# EAGLE design cartridge_reader (EAGLE 7.6.0)
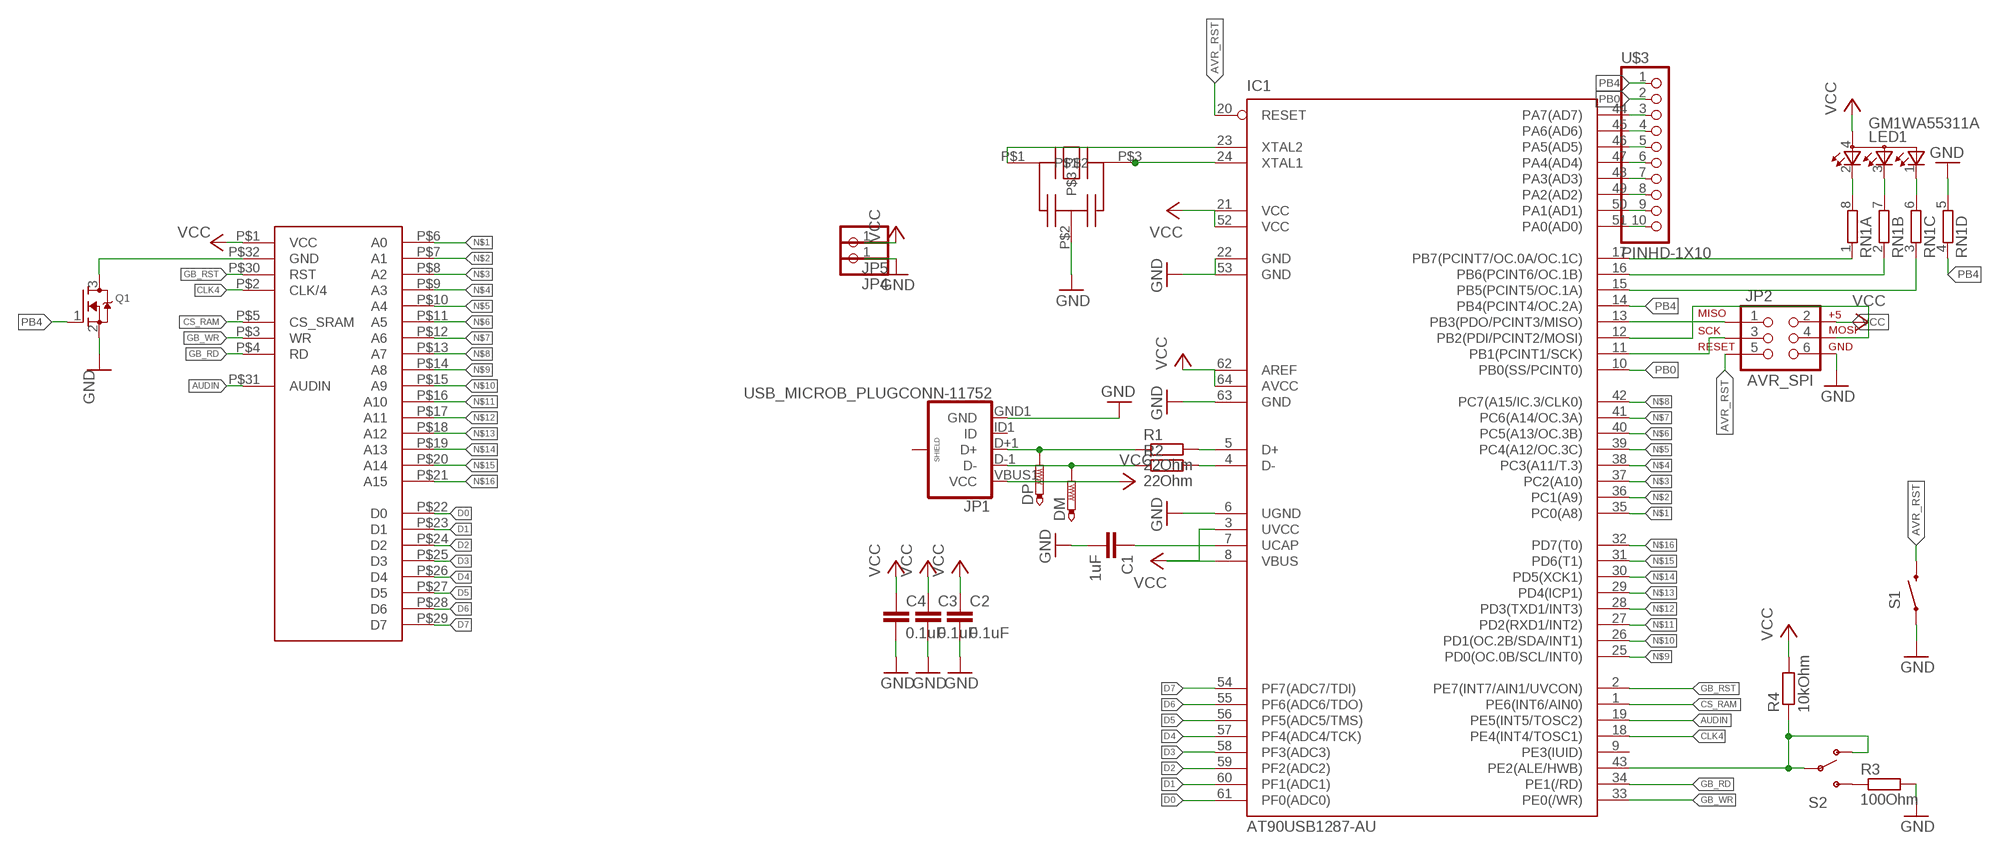
[diagram p0: schematic, sheet 1]

## Parts
C1  1uF  C-EUC0805K  [C0805K]
C2  0.1uF  C-EUC0805K  [C0805K]
C3  0.1uF  C-EUC0805K  [C0805K]
C4  0.1uF  C-EUC0805K  [C0805K]
DM  PTR1TP18R  [TP18R]
DP  PTR1TP18R  [TP18R]
IC1  AT90USB1287-AU  [TQFP64]
JP1  USB_MICROB_PLUGCONN-11752  [USB-B-MICRO-SMD_V03]
JP2  AVR_SPI  AVR_SPI_PRG_62X3_LOCK  [2X3_LOCK]
JP4  PINHD-1X1  [1X01]
JP5  PINHD-1X1  [1X01]
LED1  GM1WA55311A  [GM1WA55311A]
Q1  MOSFET-NREFLOW  [SOT23]
R1  22Ohm  R-EU_R0603  [R0603]
R2  22Ohm  R-EU_R0603  [R0603]
R3  100Ohm  R-EU_R0603  [R0603]
R4  10kOhm  R-EU_R0603  [R0603]
RN1  4R-N0603-ARC  [0603-ARC]
S1  SWITCH-MOMENTARY-2-SMD-1101NE  [TACTILE-SWITCH-1101NE]
S2  SWITCH-SPDT-SMD-A  [SWITCH-SPST-SMD-A]
U$1  GMB_SOCKET  [GAMEBOY_SOCKET]
U$2  CSTCE  [CSTCE]
U$3  PINHD-1X10  [1X10-BIG]

## Nets
AUDIN: IC1.19(PE5(INT5/TOSC2)) U$1.P$31(AUDIN)
AVR_RST: IC1.20(RESET) JP2.5 S1.P$2
CLK4: IC1.18(PE4(INT4/TOSC1)) U$1.P$2(CLK/4)
CS_RAM: IC1.1(PE6(INT6/AIN0)) U$1.P$5(CS_SRAM)
D0: IC1.61(PF0(ADC0)) U$1.P$22(D0)
D1: IC1.60(PF1(ADC1)) U$1.P$23(D1)
D2: IC1.59(PF2(ADC2)) U$1.P$24(D2)
D3: IC1.58(PF3(ADC3)) U$1.P$25(D3)
D4: IC1.57(PF4(ADC4/TCK)) U$1.P$26(D4)
D5: IC1.56(PF5(ADC5/TMS)) U$1.P$27(D5)
D6: IC1.55(PF6(ADC6/TDO)) U$1.P$28(D6)
D7: IC1.54(PF7(ADC7/TDI)) U$1.P$29(D7)
GB_RD: IC1.34(PE1(/RD)) U$1.P$4(RD)
GB_RST: IC1.2(PE7(INT7/AIN1/UVCON)) U$1.P$30(RST)
GB_WR: IC1.33(PE0(/WR)) U$1.P$3(WR)
GND: C1.2 C2.2 C3.2 C4.2 IC1.6(UGND) IC1.22(GND) IC1.53(GND) IC1.63(GND) JP1.GND1(GND) JP2.6 JP4.1 Q1.2(S) R3.2 RN1.5 S1.P$1 U$2.P$2
N$1: IC1.35(PC0(A8)) U$1.P$6(A0)
N$2: IC1.36(PC1(A9)) U$1.P$7(A1)
N$3: IC1.37(PC2(A10)) U$1.P$8(A2)
N$4: IC1.38(PC3(A11/T.3)) U$1.P$9(A3)
N$5: IC1.39(PC4(A12/OC.3C)) U$1.P$10(A4)
N$6: IC1.40(PC5(A13/OC.3B)) U$1.P$11(A5)
N$7: IC1.41(PC6(A14/OC.3A)) U$1.P$12(A6)
N$8: IC1.42(PC7(A15/IC.3/CLK0)) U$1.P$13(A7)
N$9: IC1.25(PD0(OC.0B/SCL/INT0)) U$1.P$14(A8)
N$10: IC1.26(PD1(OC.2B/SDA/INT1)) U$1.P$15(A9)
N$11: IC1.27(PD2(RXD1/INT2)) U$1.P$16(A10)
N$12: IC1.28(PD3(TXD1/INT3)) U$1.P$17(A11)
N$13: IC1.29(PD4(ICP1)) U$1.P$18(A12)
N$14: IC1.30(PD5(XCK1)) U$1.P$19(A13)
N$15: IC1.31(PD6(T1)) U$1.P$20(A14)
N$16: IC1.32(PD7(T0)) U$1.P$21(A15)
N$17: IC1.23(XTAL2) U$2.P$1
N$18: IC1.24(XTAL1) U$2.P$3
N$19: IC1.13(PB3(PDO/PCINT3/MISO)) JP2.1
N$20: IC1.12(PB2(PDI/PCINT2/MOSI)) JP2.4
N$21: DP.TP JP1.D+1(D+) R1.1
N$22: DM.TP JP1.D-1(D-) R2.1
N$23: IC1.5(D+) R1.2
N$24: IC1.4(D-) R2.2
N$25: IC1.11(PB1(PCINT1/SCK)) JP2.3
N$26: IC1.43(PE2(ALE/HWB)) R4.1 S2.1(O) S2.2(P)
N$27: C1.1 IC1.7(UCAP)
N$28: IC1.17(PB7(PCINT7/OC.0A/OC.1C)) RN1.1
N$29: IC1.16(PB6(PCINT6/OC.1B)) RN1.2
N$30: LED1.2(CRED) RN1.8
N$31: LED1.3(CBLUE) RN1.7
N$32: LED1.1(CGREEN) RN1.6
N$33: IC1.15(PB5(PCINT5/OC.1A)) RN1.3
N$34: IC1.44(PA7(AD7)) U$3.3
N$35: IC1.45(PA6(AD6)) U$3.4
N$36: IC1.46(PA5(AD5)) U$3.5
N$37: IC1.47(PA4(AD4)) U$3.6
N$38: IC1.48(PA3(AD3)) U$3.7
N$39: IC1.49(PA2(AD2)) U$3.8
N$40: IC1.50(PA1(AD1)) U$3.9
N$41: IC1.51(PA0(AD0)) U$3.10
N$42: Q1.3(D) U$1.P$32(GND)
N$43: R3.1 S2.3(S)
PB0: IC1.10(PB0(SS/PCINT0)) U$3.2
PB4: IC1.14(PB4(PCINT4/OC.2A)) Q1.1(G) RN1.4 U$3.1
VCC: C2.1 C3.1 C4.1 IC1.3(UVCC) IC1.8(VBUS) IC1.21(VCC) IC1.52(VCC) IC1.62(AREF) IC1.64(AVCC) JP1.VBUS1(VCC) JP2.2 JP5.1 LED1.4(A) R4.2 U$1.P$1(VCC)
Unconnected: IC1.9(PE3(IUID)) JP1.ID1(ID) JP1.SHIELD1(SHIELD) JP1.SHIELD2(SHIELD) JP1.SHIELD3(SHIELD)

## Library data of the parts
C1-C4 = rcl:C-EU: CAPACITOR, European symbol
DM DP = testpad:PTR1: TEST PIN
IC1 = at90usb:AT90USB1287-*: Atmel AT90USB1287 AVR Microcontroller with USB Interface and 128kB Flash Memory
JP1 = SparkFun-Connectors:USB_MICROB_PLUG: USB Micro-B connectors Some male, some female. Watch your step!; PROD_ID: CONN-11752
JP2 = SparkFun-Connectors:AVR_SPI_PRG_6: AVR ISP 6 Pin This is the reduced ISP connector for AVR programming. Common on Arduino. This footprint will take up less PCB space and can be used with a 10-pin to 6-pin adapter such as SKU: BOB-08508 **Special note about "TEST_POINT" package. The stop mask is on the top side, so if you want your programming test points to be on the bottom of your board, make sure to place this package on the bottom side of the board. This also ensure that the orientation to program from the bottom side will be correct.
JP4 JP5 = adafruit:PINHD-1X1: Pin header 1x1 for 0.1" spacing With round pins
LED1 = led:GM1WA55311A: Chip LED RGB Source: http://document.sharpsma.com/files/GM1WA55311A_SS.pdf
Q1 = adafruit:MOSFET-N: N-Channel Mosfet 2N7002E - 60V 260mA SOT23 [Digikey: 2N7002ET1GOSTR-ND] - REEL BSH103 - 30V 850mA SOT23 [Digikey: 568-5013-1-ND]
R1-R4 = rcl:R-EU_: RESISTOR, European symbol
RN1 = resistor-dil:4R-N: Array Chip Resistor Source: RS Component / Phycomp; OC_FARNELL: unknown; OC_NEWARK: unknown
S1 = SparkFun-Electromechanical:SWITCH-MOMENTARY-2: Various NO switches- pushbuttons, reed, etc
S2 = SparkFun-Electromechanical:SWITCH-SPDT: SPDT Switch Simple slide switch, Spark Fun Electronics SKU : COM-00102 DPDT SMT slide switch, AYZ0202, SWCH-08179
U$1 = GameBoy:GMB_SOCKET
U$2 = GameBoy:CSTCE
U$3 = adafruit:PINHD-1X10: Pin header 1x10 0.1" spacing With round pins

## Board
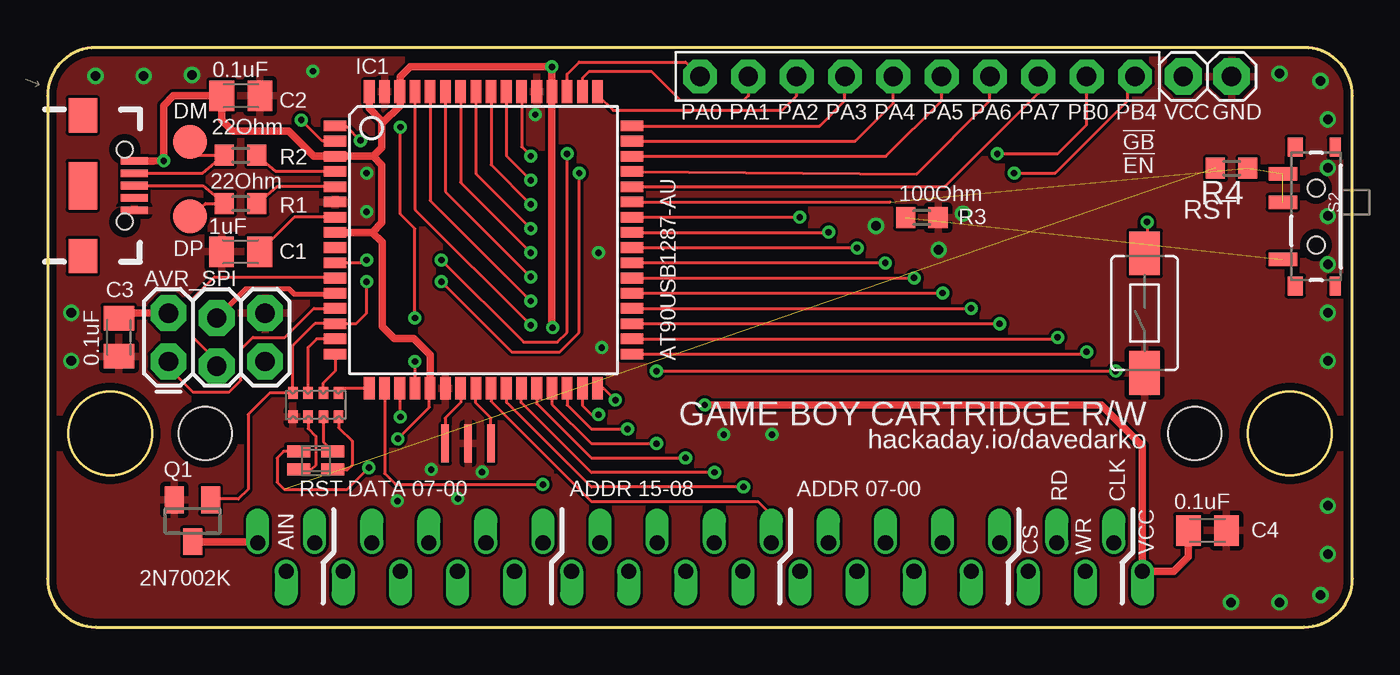
[diagram p1: board, top side]
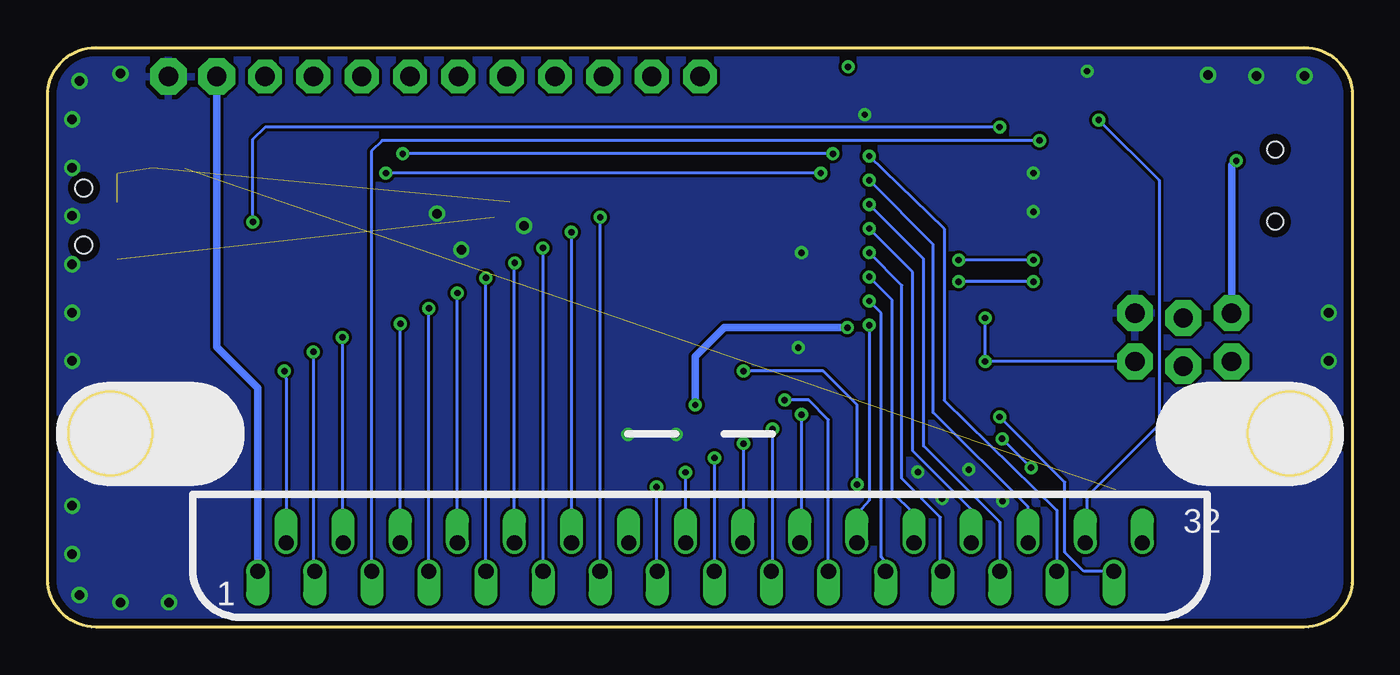
[diagram p2: board, bottom side, seen from below]

Size 68.58 x 30.48 mm. Coordinates in mm from the lower left corner, seen from the top.
Outline: 68.58,2.54 68.58,27.94 arc90 66.04,30.48 2.54,30.48 arc90 0,27.94 0,2.54 arc90 2.54,0 66.04,0 arc90 68.58,2.54
Copper layers (1*16): Top 0.0356mm / dielectric 1.5011mm / Bottom 0.0356mm
Design rules "LaenPCBOrder": minimum track width 6mil, minimum drill 13mil, track to track 6mil, track to pad 6mil, pad to pad 6mil, via to via 6mil, smd to smd 6mil, copper to edge 15mil, drill to drill 6mil, minimum pad ring 7mil, minimum via ring 7mil, stop-mask expansion 3mil, vias tented up to drill 0mil, thermal gap 10mil

### Footprints (pad centres in the part's own frame; a part is rotated, then mirrored left to right if it is on the bottom)
C0805K = smd 1.3 x 1.6: 1 -1,0; 2 1,0
TP18R = smd 1.8 x 1.8: TP 0,0
TQFP64 = smd 1.194 x 0.559: 1 -7.8,6; 2 -7.8,5.2; 3 -7.8,4.4; 4 -7.8,3.6; 5 -7.8,2.8; 6 -7.8,2; 7 -7.8,1.2; 8 -7.8,0.4; 9 -7.8,-0.4; 10 -7.8,-1.2; 11 -7.8,-2; 12 -7.8,-2.8; 13 -7.8,-3.6; 14 -7.8,-4.4; 15 -7.8,-5.2; 16 -7.8,-6; 33 7.8,-6; 34 7.8,-5.2; 35 7.8,-4.4; 36 7.8,-3.6; 37 7.8,-2.8; 38 7.8,-2; 39 7.8,-1.2; 40 7.8,-0.4; 41 7.8,0.4; 42 7.8,1.2; 43 7.8,2; 44 7.8,2.8; 45 7.8,3.6; 46 7.8,4.4; 47 7.8,5.2; 48 7.8,6 | smd 0.559 x 1.194: 17 -6,-7.8; 18 -5.2,-7.8; 19 -4.4,-7.8; 20 -3.6,-7.8; 21 -2.8,-7.8; 22 -2,-7.8; 23 -1.2,-7.8; 24 -0.4,-7.8; 25 0.4,-7.8; 26 1.2,-7.8; 27 2,-7.8; 28 2.8,-7.8; 29 3.6,-7.8; 30 4.4,-7.8; 31 5.2,-7.8; 32 6,-7.8; 49 6,7.8; 50 5.2,7.8; 51 4.4,7.8; 52 3.6,7.8; 53 2.8,7.8; 54 2,7.8; 55 1.2,7.8; 56 0.4,7.8; 57 -0.4,7.8; 58 -1.2,7.8; 59 -2,7.8; 60 -2.8,7.8; 61 -3.6,7.8; 62 -4.4,7.8; 63 -5.2,7.8; 64 -6,7.8
USB-B-MICRO-SMD_V03 = smd 1.4 x 0.4: D+1 2.7,0; D-1 2.7,0.65; GND1 2.7,-1.3; ID1 2.7,-0.65; VBUS1 2.7,1.3 | smd 1.5 x 1.8: SHIELD1 0,3.7; SHIELD2 0,-3.7 | smd 1.5 x 2.5: SHIELD3 0,0 | hole 0.85: 2.2,1.9; 2.2,-1.9
2X3_LOCK = drill 1.016 pad 1.88 octagon: 1 0,0; 2 0,2.54; 3 2.54,-0.254; 4 2.54,2.286; 5 5.08,0; 6 5.08,2.54
1X01 = drill 1.016 pad 1.93 octagon: 1 0,0
GM1WA55311A = smd 0.65 x 1.2: 1 -0.475,0.9; 2 -0.475,-0.9; 3 0.475,-0.9; 4 0.475,0.9
SOT23 = smd 1 x 1.4: 1 -0.95,-1.1; 2 0.95,-1.1; 3 0,1.1
R0603 = smd 1 x 1.1: 1 -0.85,0; 2 0.85,0
0603-ARC = smd 0.5 x 0.65: 1 -1.2,-0.625; 2 -0.4,-0.625; 3 0.4,-0.625; 4 1.2,-0.625; 5 1.2,0.625; 6 0.4,0.625; 7 -0.4,0.625; 8 -1.2,0.625
TACTILE-SWITCH-1101NE = smd 2.3 x 1.6: P$1 -3.15,0; P$2 3.15,0
SWITCH-SPST-SMD-A = smd 0.7 x 1.5: 1 -2.25,-1.75; 2 -0.75,-1.75; 3 2.25,-1.75 | smd 1 x 0.6: GND1 -3.65,1; GND3 3.65,1 | smd 1 x 0.8: GND2 -3.65,-1.1; GND4 3.65,-1.1 | hole 0.9: -1.5,0; 1.5,0
GAMEBOY_SOCKET = drill 0.8 offset: P$1 -23.25,-0.75; P$2 -21.75,0.75; P$3 -20.25,-0.75; P$4 -18.75,0.75; P$5 -17.25,-0.75; P$6 -15.75,0.75; P$7 -14.25,-0.75; P$8 -12.75,0.75; P$9 -11.25,-0.75; P$10 -9.75,0.75; P$11 -8.25,-0.75; P$12 -6.75,0.75; P$13 -5.25,-0.75; P$14 -3.75,0.75; P$15 -2.25,-0.75; P$16 -0.75,0.75; P$17 0.75,-0.75; P$18 2.25,0.75; P$19 3.75,-0.75; P$20 5.25,0.75; P$21 6.75,-0.75; P$22 8.25,0.75; P$23 9.75,-0.75; P$24 11.25,0.75; P$25 12.75,-0.75; P$26 14.25,0.75; P$27 15.75,-0.75; P$28 17.25,0.75; P$29 18.75,-0.75; P$30 20.25,0.75; P$31 21.75,-0.75; P$32 23.25,0.75 | hole 2.8: -26,6.5; 26,6.5
CSTCE = smd 0.4 x 2: P$1 -1.2,0; P$2 0,0; P$3 1.2,0
1X10-BIG = drill 1.016 pad 1.778 octagon: 1 -11.43,0; 2 -8.89,0; 3 -6.35,0; 4 -3.81,0; 5 -1.27,0; 6 1.27,0; 7 3.81,0; 8 6.35,0; 9 8.89,0; 10 11.43,0

### Placement (x,y rotation side)
C1  10.15,19.74 180 top
C2  10.16,27.94 0 top
C3  3.75,15.24 270 top
C4  60.96,5.08 0 top
DM  7.49,25.53 0 top
DP  7.49,21.59 0 top
IC1  22.91,20.36 0 top
JP1  1.85,23.22 0 top
JP2  6.35,13.97 0 top
JP4  62.23,28.96 0 top
JP5  59.69,28.96 0 top
LED1  14.1,8.76 90 top
Q1  7.62,5.59 180 top
R1  10.15,22.28 0 top
R2  10.15,24.82 0 top
R3  45.95,21.54 0 top
R4  62.23,24.13 180 top
RN1  14.1,11.68 180 top
S1  57.66,16.51 90 top
S2  66.67,21.59 270 top
U$1  34.29,3.68 0 bottom
U$2  22.1,9.65 0 top
U$3  45.72,28.96 180 top

### Tracks (layer width: path | path; a pad name or v marks a point on that pad's centre or on a via)
AUDIN  (via drill 0.33)
  Top 0.152: v18.54,11.05 18.54,12.53 IC1.19
  Bottom 0.152: U$1.P$31 14.11,2.93 15.11,3.94 15.11,7.62 v18.54,11.05
AVR_RST  (via drill 0.33)
  Top 0.152: v19.3,13.97 IC1.20 | v19.3,16.26 19.3,20.95 18.54,21.72 v18.54,26.29 | v57.78,21.31 57.78,19.96 S1.P$2
  Bottom 0.152: JP2.5 v19.3,13.97 v19.3,16.26 | v18.54,26.29 57.15,26.29 57.78,25.65 v57.78,21.31
CLK4  (via drill 0.33)
  Top 0.152: IC1.18 17.71,8.07 18.29,7.49 v26.04,7.49 | v32,13.46 v56.13,13.46
  Bottom 0.152: v26.04,7.49 26.04,11.68 27.81,13.46 v32,13.46 | v56.13,13.46 56.04,13.05 U$1.P$2
CS_RAM  (via drill 0.33)
  Top 0.152: IC1.1 15.69,26.36 v16.45,25.59
  Bottom 0.152: v16.45,25.59 50.99,25.59 51.56,25.02 51.56,2.96 U$1.P$5
D0  (via drill 0.33)
  Top 0.152: IC1.61 19.31,21.97 v25.4,15.88
  Bottom 0.152: v25.4,15.88 25.4,6.67 26.04,5.95 U$1.P$22
D1  (via drill 0.33)
  Top 0.152: IC1.60 20.11,22.44 v25.4,17.14
  Bottom 0.152: U$1.P$23 24.51,3.3 24.77,3.68 24.77,16.51 v25.4,17.14
D2  (via drill 0.33)
  Top 0.152: IC1.59 20.91,22.91 v25.4,18.41
  Bottom 0.152: U$1.P$24 23.04,5.98 24.19,7.05 24.19,17.21 v25.4,18.41
D3  (via drill 0.33)
  Top 0.152: IC1.58 21.71,23.38 v25.4,19.68
  Bottom 0.152: U$1.P$25 21.65,3.11 21.65,5.78 23.69,7.81 23.69,17.97 v25.4,19.68
D4  (via drill 0.33)
  Top 0.152: IC1.57 22.51,23.85 v25.4,20.95
  Bottom 0.152: U$1.P$26 20.04,6.2 23.11,9.27 23.11,18.67 v25.4,20.95
D5  (via drill 0.33)
  Top 0.152: IC1.56 23.31,24.32 v25.4,22.23
  Bottom 0.152: U$1.P$27 18.54,5.52 22.54,9.53 22.54,19.37 v25.4,22.23
D6  (via drill 0.33)
  Top 0.152: IC1.55 24.11,24.79 v25.4,23.5
  Bottom 0.152: U$1.P$28 17.04,6.33 22.04,11.28 22.04,20.13 v25.4,23.5
D7  (via drill 0.33)
  Top 0.152: IC1.54 24.91,25.26 v25.4,24.77
  Bottom 0.152: U$1.P$29 15.54,6.14 21.46,11.92 21.46,20.95 v25.4,24.77
GB_RD  (via drill 0.33)
  Top 0.152: IC1.34 53,15.16 v53.09,15.24
  Bottom 0.152: v53.09,15.24 53.09,4.48 U$1.P$4
GB_RST  (via drill 0.33)
  Top 0.152: IC1.2 14.45,25.56 v13.34,26.67
  Bottom 0.152: v13.34,26.67 10.16,23.5 10.16,10.67 13.97,6.86 13.97,4.87 U$1.P$30
GB_WR  (via drill 0.33)
  Top 0.152: IC1.33 54.49,14.36 v54.61,14.48
  Bottom 0.152: v54.61,14.48 54.61,3 U$1.P$3
GND  (via drill 0.33, 0.5)
  Top 0.254: 20.89,12.57 IC1.22
  other vias: 16.76,23.88 16.76,21.84 13.94,29.24 7.59,29.04 5.05,28.98 2.51,28.98 1.24,16.54 1.24,14 62.2,1.3 67.28,3.84 64.74,1.3 66.9,1.68 67.28,6.38 67.28,14 67.28,16.54 67.28,19.08 67.28,21.62 67.28,24.16 67.28,26.7 66.9,28.73 35.53,10.12 38.07,10.12 28.96,19.68 18.39,6.63 21.56,6.76 29.12,14.69 20.17,8.28 22.83,8.15 25.63,26.95 64.74,29.11 46.84,19.84 48.11,21.74 43.54,21.11
  pour Top: -3.81,-2.54 -3.81,35.56 72.39,35.56 72.39,-2.54
  pour Bottom: -6.35,-5.08 -6.35,33.02 69.85,33.02 69.85,-5.08
N$1  (via drill 0.33)
  Top 0.152: IC1.35 49.99,15.96 v50.04,15.95
  Bottom 0.152: U$1.P$6 50.04,16 v50.04,15.95
N$2  (via drill 0.33)
  Top 0.152: IC1.36 48.25,16.76 v48.54,16.76
  Bottom 0.152: U$1.P$7 48.54,16.71 v48.54,16.76
N$3  (via drill 0.33)
  Top 0.152: IC1.37 46.77,17.56 v47.04,17.56
  Bottom 0.152: U$1.P$8 47.04,17.54 v47.04,17.56
N$4  (via drill 0.33)
  Top 0.152: IC1.38 45.4,18.36 v45.54,18.36
  Bottom 0.152: U$1.P$9 45.54,18.34 v45.54,18.36
N$5  (via drill 0.33)
  Top 0.152: IC1.39 43.99,19.16 v44.03,19.15
  Bottom 0.152: U$1.P$10 44.04,19.02 v44.03,19.15
N$6  (via drill 0.33)
  Top 0.152: IC1.40 42.53,19.96 v42.55,19.94
  Bottom 0.152: U$1.P$11 42.54,19.87 v42.55,19.94
N$7  (via drill 0.33)
  Top 0.152: IC1.41 40.71,20.76 v41.05,20.77
  Bottom 0.152: U$1.P$12 41.04,20.75 v41.05,20.77
N$8  (via drill 0.33)
  Top 0.152: IC1.42 v39.54,21.56 v39.53,21.55
  Bottom 0.152: U$1.P$13 39.54,21.51 v39.53,21.55
N$9
  Top 0.152: IC1.25 23.31,11.87 28.57,6.6 37.34,6.6 38.1,5.84 38.1,4.63 U$1.P$14
N$10  (via drill 0.33)
  Top 0.152: v36.58,7.37 28.57,7.37 24.13,11.81 24.13,12.54 IC1.26
  Bottom 0.152: U$1.P$15 36.54,3.08 36.58,3.3 v36.58,7.37
N$11  (via drill 0.33)
  Top 0.152: v35.05,8.13 28.57,8.13 24.89,11.81 24.89,12.54 IC1.27
  Bottom 0.152: U$1.P$16 35.04,7.86 v35.05,8.13
N$12  (via drill 0.33)
  Top 0.152: IC1.28 25.71,11.76 28.57,8.89 v33.53,8.89
  Bottom 0.152: v33.53,8.89 33.53,2.94 U$1.P$17
N$13  (via drill 0.33)
  Top 0.152: IC1.29 26.51,11.72 28.57,9.65 v32,9.65
  Bottom 0.152: v32,9.65 32,4.47 U$1.P$18
N$14  (via drill 0.33)
  Top 0.152: IC1.30 27.31,11.68 28.57,10.41 v30.48,10.41
  Bottom 0.152: v30.48,10.41 30.48,2.99 U$1.P$19
N$15  (via drill 0.33)
  Top 0.152: IC1.31 28.11,11.64 28.57,11.18 v28.96,11.18
  Bottom 0.152: v28.96,11.18 28.96,4.52 U$1.P$20
N$16  (via drill 0.33)
  Top 0.152: IC1.32 29.23,12.56 v29.84,11.94
  Bottom 0.152: U$1.P$21 27.54,10.9 28.57,11.94 v29.84,11.94
N$17
  Top 0.152: IC1.23 21.71,11.8 20.9,10.99 U$2.P$1
N$18
  Top 0.152: U$2.P$3 23.3,10.99 22.51,11.78 IC1.24
N$19
  Top 0.152: JP2.1 6.35,13.64 7.62,12.37 9.55,12.37 10.16,12.98 10.16,14.61 10.79,15.24 12.47,15.24 13.99,16.76 IC1.13
N$20
  Top 0.152: 15.05,17.5 IC1.12
  Top 0.254: 15.05,17.5 12.98,17.5 12.7,17.78 10.41,17.78 JP2.4
N$21
  Top 0.152: JP1.D+1 8.14,23.22 R1.1 8.31,22.28 DP.TP
N$22
  Top 0.152: JP1.D-1 8.14,23.87 R2.1 7.95,24.82 DM.TP
N$23
  Top 0.152: IC1.5 12.04,23.16 R1.2
N$24
  Top 0.152: IC1.4 12.02,23.96 R2.2
N$25
  Top 0.152: JP2.3 8.89,13.99 7.62,15.27 7.62,17.27 8.76,18.41 15.05,18.41 IC1.11
N$26  (3 unrouted)
  Top 0.152: IC1.43 44.28,22.36
N$27
  Top 0.152: IC1.7 12.97,21.56 C1.1
N$28
  Top 0.152: IC1.17 15.55,12.56 RN1.1
N$29
  Top 0.152: IC1.16 15.11,13.46 14.5,12.85 RN1.2
N$30
  Top 0.152: RN1.8 15.3,10.48 16,9.78 16,8.51 15.75,8.26 15.03,8.26 LED1.2
N$31
  Top 0.152: RN1.7 14.5,9.74 LED1.3
N$32
  Top 0.152: RN1.6 13.7,10.43 14.1,10.03 14.1,8.51 13.84,8.26 13.23,8.26 LED1.1
N$33
  Top 0.152: RN1.3 13.7,14.71 14.14,15.16 IC1.15
N$34
  Top 0.152: IC1.44 47.16,23.16 52.07,28.07 U$3.3
N$35
  Top 0.152: IC1.45 45.67,23.83 49.53,27.69 U$3.4
N$36
  Top 0.152: IC1.46 44.06,24.76 46.99,27.69 U$3.5
N$37
  Top 0.152: IC1.47 42.45,25.56 44.45,27.56 U$3.6
N$38
  Top 0.152: IC1.48 40.58,26.36 41.91,27.69 U$3.7
N$39
  Top 0.152: IC1.49 28.91,27.99 29.72,27.18 38.61,27.18 39.37,27.94 U$3.8
N$40
  Top 0.152: U$3.9 36.83,27.94 36.58,27.69 33.27,27.69 31.75,29.21 28.45,29.21 28.11,28.87 IC1.50
N$41
  Top 0.152: IC1.51 27.31,29.09 27.94,29.72 33.53,29.72 U$3.10
N$42
  Top 0.406: Q1.3 10.98,4.49 U$1.P$32
N$43  (1 unrouted)
PB0  (via drill 0.33)
  Top 0.152: IC1.10 16.62,19.16 v16.76,19.3 | v20.7,19.3 25.02,14.99 26.8,14.99 27.3,15.49 v27.3,24.89 | v49.91,24.89 53.09,24.89 54.61,26.42 U$3.2
  Bottom 0.152: v16.76,19.3 v20.7,19.3 | v27.3,24.89 v49.91,24.89
PB4  (via drill 0.33)
  Top 0.152: v16.76,18.16 16.76,16.51 16.21,15.96 IC1.14 14.05,15.96 12.9,14.8 RN1.4 11.67,12.31 10.54,11.18 10.54,7.24 10.03,6.73 8.61,6.73 Q1.1 | v27.94,23.88 27.94,15.49 26.92,14.48 24.38,14.48 v20.7,18.16 | v50.8,23.88 52.96,23.88 56.77,27.69 56.77,28.96 U$3.1
  Bottom 0.152: v27.94,23.88 v50.8,23.88 | v16.76,18.16 v20.7,18.16
VCC  (via drill 0.33)  (1 unrouted)
  Top 0.152: LED1.4 12.41,9.24 12.06,8.89 12.06,7.62 12.45,7.24 15.75,7.24 v16.89,8.38 | v18.41,9.91 20.07,11.56 20.07,12.52 IC1.21
  Top 0.254: 9.14,27.94 C2.1
  Top 0.406: JP1.VBUS1 5.59,24.52 v6.11,24.52 6.1,26.29 6.1,27.43 6.6,27.94 9.14,27.94 | 17.13,24.76 IC1.3 14.34,24.77 13.99,24.77 12.68,26.09 9.73,26.09 9.14,26.67 9.14,27.92 C2.1 9.08,27.81 9.21,27.67 | 17.13,24.76 17.58,24.31 17.58,21.26 17.07,20.75 | IC1.64 16.91,27.29 17.58,26.62 | 17.58,26.62 17.6,26.49 18.54,27.43 18.54,28.12 | 18.54,28.12 IC1.62 | 17.58,26.62 17.58,25.22 17.13,24.76 | 18.54,28.12 18.54,28.96 19.05,29.46 v26.51,29.46 IC1.52 26.51,15.91 v26.54,15.75 | 17.07,20.75 17.59,20.26 17.59,15.81 18.22,15.18 19.24,15.18 20.11,14.31 IC1.21 | C3.1 4.02,16.51 JP2.2 | v34.54,11.68 55.37,11.68 57.54,9.52 U$1.P$1 59.19,2.93 59.96,3.7 C4.1 | IC1.8 17.07,20.75
  Bottom 0.152: v16.89,8.38 v18.41,9.91
  Bottom 0.406: 57.54,7.11 U$1.P$1 57.54,11.55 57.53,11.56 57.53,12.57 59.69,14.73 JP5.1 | v34.54,11.68 34.54,14.22 33.02,15.75 v26.54,15.75 | v6.11,24.52 6.35,24.28 JP2.2

### Text on the board
tNames: PA0 | PA1 | PA2 | PA3 | PA4 | PA5 | PA6 | PA7 | PB0 | PB4 | VCC | GND | !GB / !EN | RST | GAME BOY CARTRIDGE R/W | hackaday.io/davedarko | RST | DATA 07-00 | ADDR 15-08 | ADDR 07-00 | RD | CLK | AIN | CS | WR | VCC | 2N7002K